# EAGLE design Teensy_Board_Connectors (EAGLE 7.0.0)
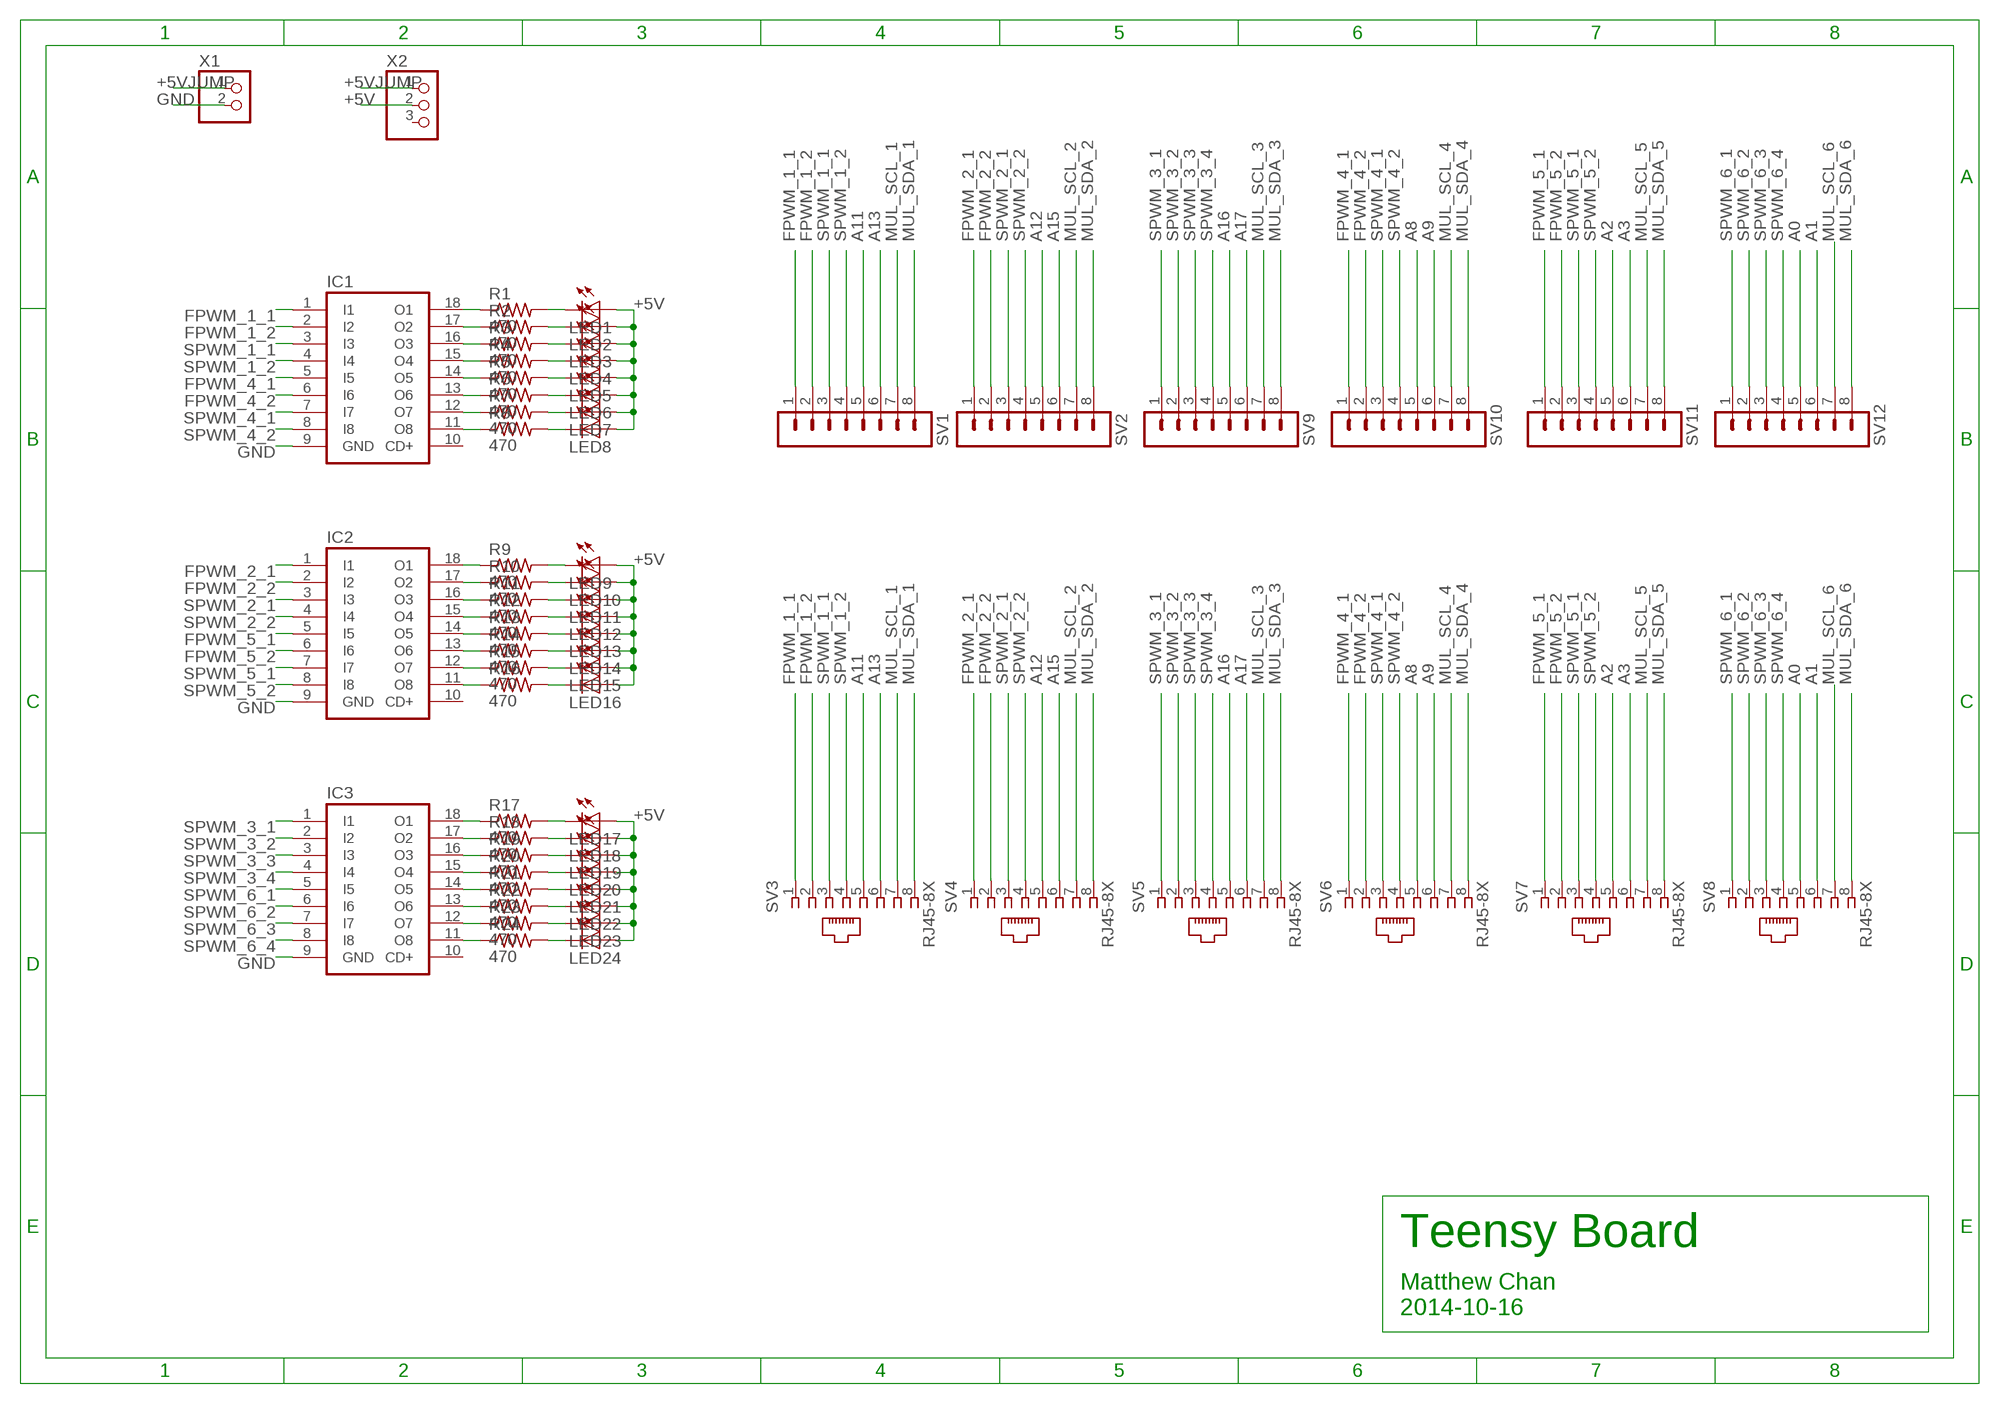
[diagram p0: schematic, sheet 1]

## Parts
IC1  ULN2803AFWG  [SOP18]
IC2  ULN2803AFWG  [SOP18]
IC3  ULN2803AFWG  [SOP18]
LED1  LEDSML1206  [SML1206]
LED2  LEDSML1206  [SML1206]
LED3  LEDSML1206  [SML1206]
LED4  LEDSML1206  [SML1206]
LED5  LEDSML1206  [SML1206]
LED6  LEDSML1206  [SML1206]
LED7  LEDSML1206  [SML1206]
LED8  LEDSML1206  [SML1206]
LED9  LEDSML1206  [SML1206]
LED10  LEDSML1206  [SML1206]
LED11  LEDSML1206  [SML1206]
LED12  LEDSML1206  [SML1206]
LED13  LEDSML1206  [SML1206]
LED14  LEDSML1206  [SML1206]
LED15  LEDSML1206  [SML1206]
LED16  LEDSML1206  [SML1206]
LED17  LEDSML1206  [SML1206]
LED18  LEDSML1206  [SML1206]
LED19  LEDSML1206  [SML1206]
LED20  LEDSML1206  [SML1206]
LED21  LEDSML1206  [SML1206]
LED22  LEDSML1206  [SML1206]
LED23  LEDSML1206  [SML1206]
LED24  LEDSML1206  [SML1206]
R1  470  R-US_R0603  [R0603]
R2  470  R-US_R0603  [R0603]
R3  470  R-US_R0603  [R0603]
R4  470  R-US_R0603  [R0603]
R5  470  R-US_R0603  [R0603]
R6  470  R-US_R0603  [R0603]
R7  470  R-US_R0603  [R0603]
R8  470  R-US_R0603  [R0603]
R9  470  R-US_R0603  [R0603]
R10  470  R-US_R0603  [R0603]
R11  470  R-US_R0603  [R0603]
R12  470  R-US_R0603  [R0603]
R13  470  R-US_R0603  [R0603]
R14  470  R-US_R0603  [R0603]
R15  470  R-US_R0603  [R0603]
R16  470  R-US_R0603  [R0603]
R17  470  R-US_R0603  [R0603]
R18  470  R-US_R0603  [R0603]
R19  470  R-US_R0603  [R0603]
R20  470  R-US_R0603  [R0603]
R21  470  R-US_R0603  [R0603]
R22  470  R-US_R0603  [R0603]
R23  470  R-US_R0603  [R0603]
R24  470  R-US_R0603  [R0603]
SV1  MA08-1  [MA08-1]
SV2  MA08-1  [MA08-1]
SV3  RJ45-8X  [RJ45-NO-SHIELD]
SV4  RJ45-8X  [RJ45-NO-SHIELD]
SV5  RJ45-8X  [RJ45-NO-SHIELD]
SV6  RJ45-8X  [RJ45-NO-SHIELD]
SV7  RJ45-8X  [RJ45-NO-SHIELD]
SV8  RJ45-8X  [RJ45-NO-SHIELD]
SV9  MA08-1  [MA08-1]
SV10  MA08-1  [MA08-1]
SV11  MA08-1  [MA08-1]
SV12  MA08-1  [MA08-1]
X1  PINHD-1X2  [1X02]
X2  PINHD-1X3  [1X03]

## Nets
+5V: LED1.A LED2.A LED3.A LED4.A LED5.A LED6.A LED7.A LED8.A LED9.A LED10.A LED11.A LED12.A LED13.A LED14.A LED15.A LED16.A LED17.A LED18.A LED19.A LED20.A LED21.A LED22.A LED23.A LED24.A X2.2
+5VJUMP: X1.1 X2.1
A0: SV8.5 SV12.5
A1: SV8.6 SV12.6
A2: SV7.5 SV11.5
A3: SV7.6 SV11.6
A8: SV6.5 SV10.5
A9: SV6.6 SV10.6
A11: SV1.5 SV3.5
A12: SV2.5 SV4.5
A13: SV1.6 SV3.6
A15: SV2.6 SV4.6
A16: SV5.5 SV9.5
A17: SV5.6 SV9.6
FPWM_1_1: IC1.1(I1) SV1.1 SV3.1
FPWM_1_2: IC1.2(I2) SV1.2 SV3.2
FPWM_2_1: IC2.1(I1) SV2.1 SV4.1
FPWM_2_2: IC2.2(I2) SV2.2 SV4.2
FPWM_4_1: IC1.5(I5) SV6.1 SV10.1
FPWM_4_2: IC1.6(I6) SV6.2 SV10.2
FPWM_5_1: IC2.5(I5) SV7.1 SV11.1
FPWM_5_2: IC2.6(I6) SV7.2 SV11.2
GND: IC1.9(GND) IC2.9(GND) IC3.9(GND) X1.2
MUL_SCL_1: SV1.7 SV3.7
MUL_SCL_2: SV2.7 SV4.7
MUL_SCL_3: SV5.7 SV9.7
MUL_SCL_4: SV6.7 SV10.7
MUL_SCL_5: SV7.7 SV11.7
MUL_SCL_6: SV8.7 SV12.7
MUL_SDA_1: SV1.8 SV3.8
MUL_SDA_2: SV2.8 SV4.8
MUL_SDA_3: SV5.8 SV9.8
MUL_SDA_4: SV6.8 SV10.8
MUL_SDA_5: SV7.8 SV11.8
MUL_SDA_6: SV8.8 SV12.8
N$1: IC1.18(O1) R1.1
N$2: LED1.C R1.2
N$3: IC1.17(O2) R2.1
N$4: IC1.16(O3) R3.1
N$5: IC1.15(O4) R4.1
N$6: IC1.14(O5) R5.1
N$7: IC1.13(O6) R6.1
N$8: IC1.12(O7) R7.1
N$10: IC1.11(O8) R8.1
N$11: LED2.C R2.2
N$12: LED3.C R3.2
N$13: LED4.C R4.2
N$14: LED5.C R5.2
N$15: LED6.C R6.2
N$16: LED7.C R7.2
N$17: LED8.C R8.2
N$18: IC2.18(O1) R9.1
N$19: LED9.C R9.2
N$20: IC2.17(O2) R10.1
N$21: IC2.16(O3) R11.1
N$22: IC2.15(O4) R12.1
N$23: IC2.14(O5) R13.1
N$24: IC2.13(O6) R14.1
N$25: IC2.12(O7) R15.1
N$26: IC2.11(O8) R16.1
N$27: LED10.C R10.2
N$28: LED11.C R11.2
N$29: LED12.C R12.2
N$30: LED13.C R13.2
N$31: LED14.C R14.2
N$32: LED15.C R15.2
N$33: LED16.C R16.2
N$34: IC3.18(O1) R17.1
N$35: LED17.C R17.2
N$36: IC3.17(O2) R18.1
N$37: IC3.16(O3) R19.1
N$38: IC3.15(O4) R20.1
N$39: IC3.14(O5) R21.1
N$40: IC3.13(O6) R22.1
N$41: IC3.12(O7) R23.1
N$42: IC3.11(O8) R24.1
N$43: LED18.C R18.2
N$44: LED19.C R19.2
N$45: LED20.C R20.2
N$46: LED21.C R21.2
N$47: LED22.C R22.2
N$48: LED23.C R23.2
N$49: LED24.C R24.2
SPWM_1_1: IC1.3(I3) SV1.3 SV3.3
SPWM_1_2: IC1.4(I4) SV1.4 SV3.4
SPWM_2_1: IC2.3(I3) SV2.3 SV4.3
SPWM_2_2: IC2.4(I4) SV2.4 SV4.4
SPWM_3_1: IC3.1(I1) SV5.1 SV9.1
SPWM_3_2: IC3.2(I2) SV5.2 SV9.2
SPWM_3_3: IC3.3(I3) SV5.3 SV9.3
SPWM_3_4: IC3.4(I4) SV5.4 SV9.4
SPWM_4_1: IC1.7(I7) SV6.3 SV10.3
SPWM_4_2: IC1.8(I8) SV6.4 SV10.4
SPWM_5_1: IC2.7(I7) SV7.3 SV11.3
SPWM_5_2: IC2.8(I8) SV7.4 SV11.4
SPWM_6_1: IC3.5(I5) SV8.1 SV12.1
SPWM_6_2: IC3.6(I6) SV8.2 SV12.2
SPWM_6_3: IC3.7(I7) SV8.3 SV12.3
SPWM_6_4: IC3.8(I8) SV8.4 SV12.4
Unconnected: IC1.10(CD+) IC2.10(CD+) IC3.10(CD+) X2.3

## Notes on the sheet
- Teensy Board
- Matthew Chan
  2014-10-16

## Library data of the parts
IC1-IC3 = CBLA_Test_bed_Library:ULN2803A: DRIVER ARRAY
LED1-LED24 = led:LED: LED OSRAM: - CHIPLED LG R971, LG N971, LY N971, LG Q971, LY Q971, LO R971, LY R971 LH N974, LH R974 LS Q976, LO Q976, LY Q976 LO Q996 - Hyper CHIPLED LW Q18S LB Q993, LB Q99A, LB R99A - SideLED LS A670, LO A670, LY A670, LG A670, LP A670 LB A673, LV A673, LT A673, LW A673 LH A674 LY A675 LS A676, LA A676, LO A676, LY A676, LW A676 LS A679, LY A679, LG A679 - Hyper Micro SIDELED® LS Y876, LA Y876, LO Y876, LY Y876 LT Y87S - SmartLED LW L88C, LW L88S LB L89C, LB L89S, LG L890 LS L89K, LO L89K, LY L89K LS L896, LA L896, LO L896, LY L896 - TOPLED LS T670, LO T670, LY T670, LG T670, LP T670 LSG T670, LSP T670, LSY T670, LOP T670, LYG T670 LG T671, LOG T671, LSG T671 LB T673, LV T673, LT T673, LW T673 LH T674 LS T676, LA T676, LO T676, LY T676, LB T676, LH T676, LSB T676, LW T676 LB T67C, LV T67C, LT T67C, LS T67K, LO T67K, LY T67K, LW E67C LS E67B, LA E67B, LO E67B, LY E67B, LB E67C, LV E67C, LT E67C LW T67C LS T679, LY T679, LG T679 LS T770, LO T770, LY T770, LG T770, LP T770 LB T773, LV T773, LT T773, LW T773 LH T774 LS E675, LA E675, LY E675, LS T675 LS T776, LA T776, LO T776, LY T776, LB T776 LHGB T686 LT T68C, LB T68C - Hyper Mini TOPLED® LB M676 - Mini TOPLED Santana® LG M470 LS M47K, LO M47K, LY M47K Source: http://www.osram.convergy.de LUXEON: - LUMILED® LXK2-PW12-R00, LXK2-PW12-S00, LXK2-PW14-U00, LXK2-PW14-V00 LXK2-PM12-R00, LXK2-PM12-S00, LXK2-PM14-U00 LXK2-PE12-Q00, LXK2-PE12-R00, LXK2-PE12-S00, LXK2-PE14-T00, LXK2-PE14-U00 LXK2-PB12-K00, LXK2-PB12-L00, LXK2-PB12-M00, LXK2-PB14-N00, LXK2-PB14-P00, LXK2-PB14-Q00 LXK2-PR12-L00, LXK2-PR12-M00, LXK2-PR14-Q00, LXK2-PR14-R00 LXK2-PD12-Q00, LXK2-PD12-R00, LXK2-PD12-S00 LXK2-PH12-R00, LXK2-PH12-S00 LXK2-PL12-P00, LXK2-PL12-Q00, LXK2-PL12-R00 Source: www.luxeon.com KINGBRIGHT: KA-3528ASYC Source: www.kingbright.com
R1-R24 = CBLA_Test_bed_Library:R-US_: RESISTOR, American symbol
SV1 SV2 SV9-SV12 = con-lstb:MA08-1: PIN HEADER; OC_FARNELL: unknown; OC_NEWARK: unknown
SV3-SV8 = CBLA_Test_bed_Library:RJ45: CORCOM Modular RJ Jacks No Shield Source: www.tycoelectronics.com .. ENG_DS_1654001_1099_RJ_L_0507.pdf; MPN: RJ45-8X; OC_FARNELL: unknown; OC_NEWARK: 16R6101
X1 = CBLA_Test_bed_Library:PINHD-1X2: PIN HEADER
X2 = CBLA_Test_bed_Library:PINHD-1X3: PIN HEADER

## Board
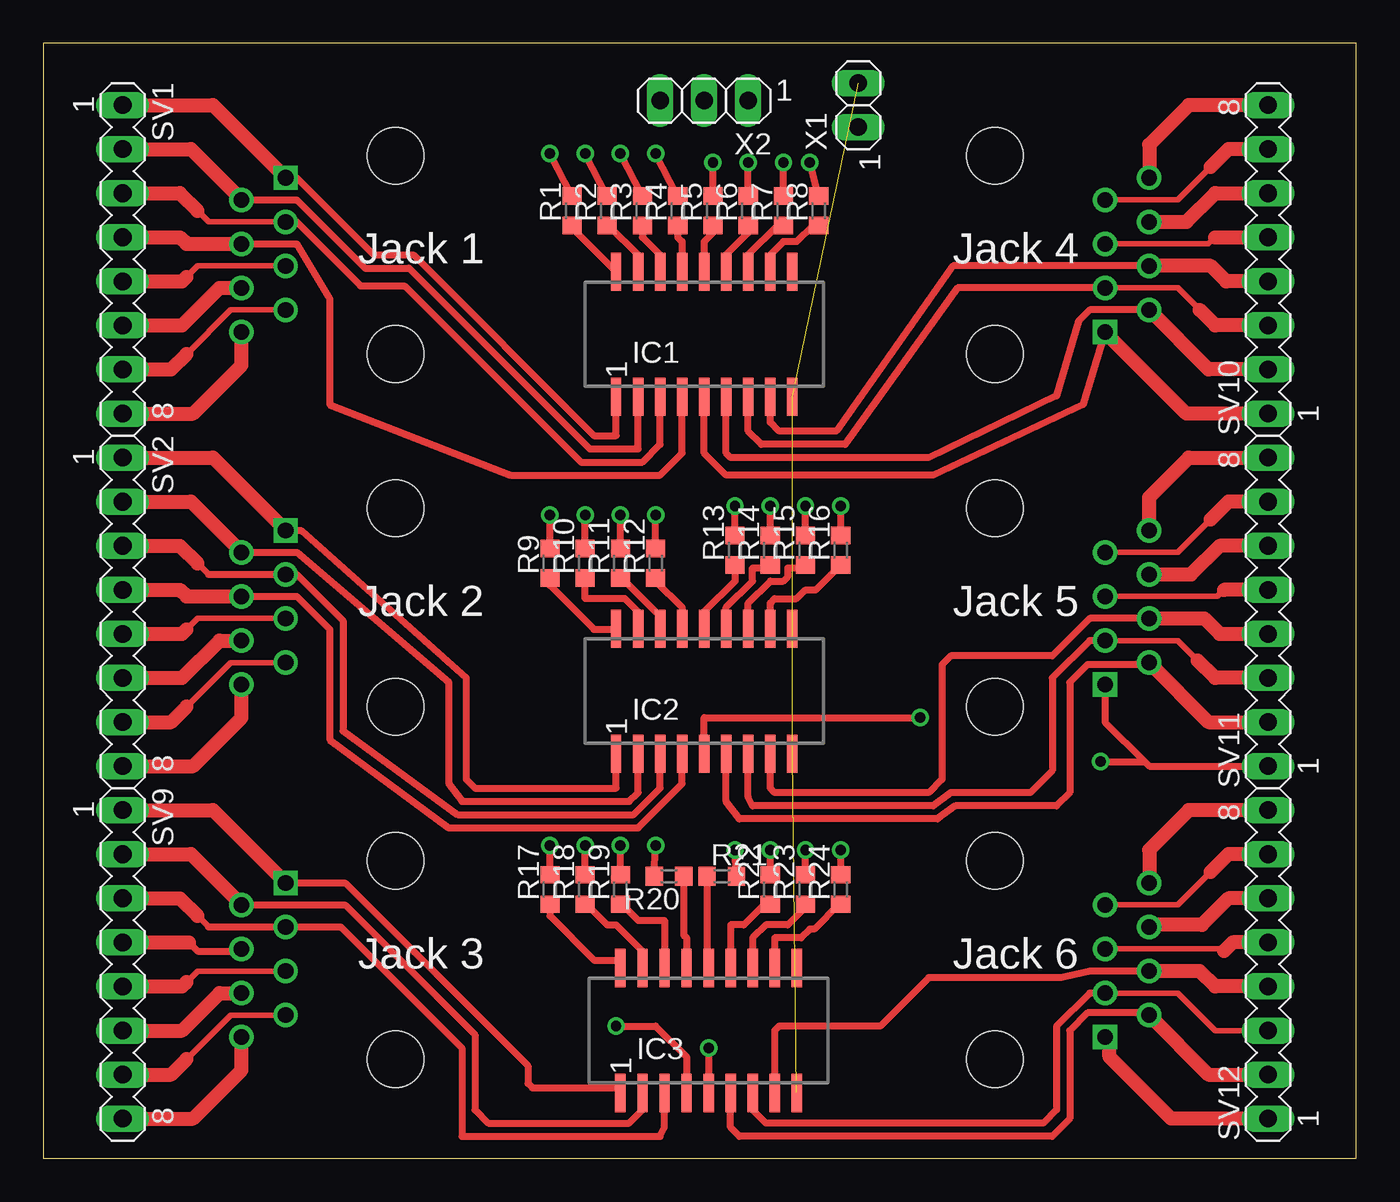
[diagram p1: board, top side]
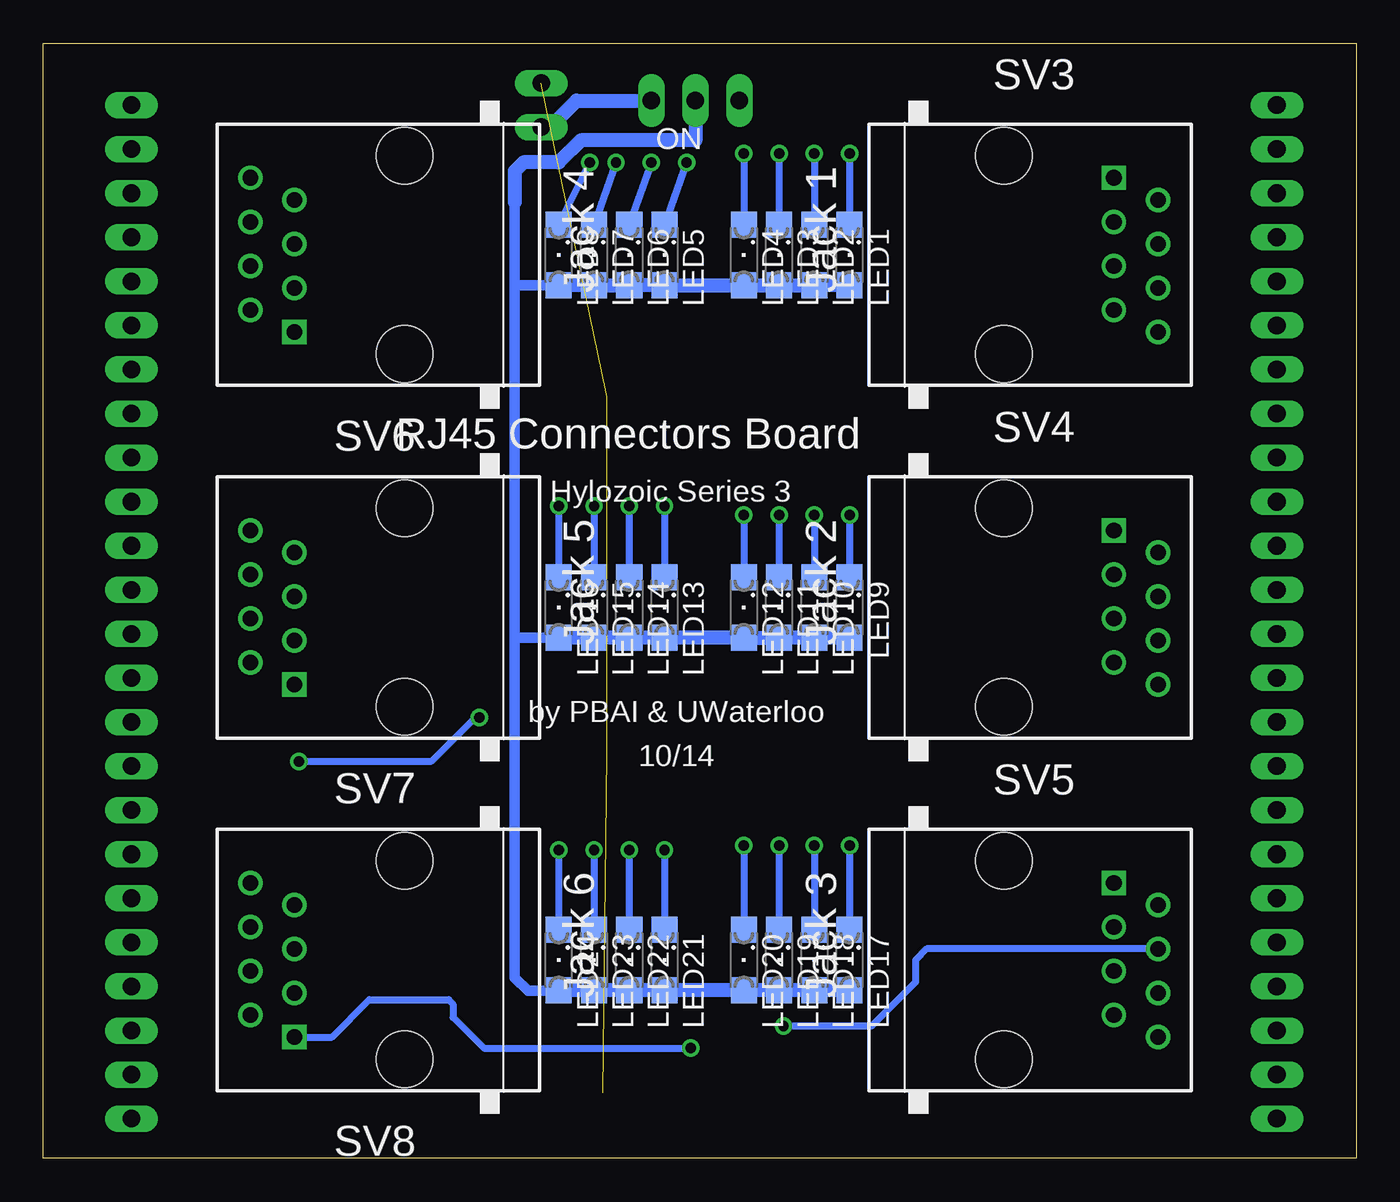
[diagram p2: board, bottom side, seen from below]

Size 75.69 x 64.26 mm. Coordinates in mm from the lower left corner, seen from the top.
Outline: 0,0 75.69,0 75.69,64.26 0,64.26 0,0
Copper layers (1*16): Top 0.035mm / dielectric 1.5mm / Bottom 0.035mm
Design rules "default": minimum track width 10mil, minimum drill 24mil, track to track 8mil, track to pad 8mil, pad to pad 8mil, via to via 8mil, smd to smd 8mil, copper to edge 40mil, drill to drill 8mil, minimum pad ring 10mil, minimum via ring 8mil, stop-mask expansion 4mil, vias tented up to drill 0mil, thermal gap 10mil

### Footprints (pad centres in the part's own frame; a part is rotated, then mirrored left to right if it is on the bottom)
SOP18 = smd 0.6 x 2.2: 1 -5.08,-3.6; 2 -3.81,-3.6; 3 -2.54,-3.6; 4 -1.27,-3.6; 5 0,-3.6; 6 1.27,-3.6; 7 2.54,-3.6; 8 3.81,-3.6; 9 5.08,-3.6; 10 5.08,3.6; 11 3.81,3.6; 12 2.54,3.6; 13 1.27,3.6; 14 0,3.6; 15 -1.27,3.6; 16 -2.54,3.6; 17 -3.81,3.6; 18 -5.08,3.6
SML1206 = smd 1.5 x 1.5: A 1.75,0; C -1.75,0
R0603 = smd 1 x 1.1: 1 -0.85,0; 2 0.85,0
MA08-1 = drill 1.016 long: 1 -8.89,0; 2 -6.35,0; 3 -3.81,0; 4 -1.27,0; 5 1.27,0; 6 3.81,0; 7 6.35,0; 8 8.89,0
RJ45-NO-SHIELD = drill 0.9 pad 1.4 square: 1 -4.445,6.35 | drill 0.9 pad 1.4: 2 -3.175,8.89; 3 -1.905,6.35; 4 -0.635,8.89; 5 0.635,6.35; 6 1.905,8.89; 7 3.175,6.35; 8 4.445,8.89 | hole 3.251: -5.715,0; 5.715,0
1X02 = drill 1.016 long: 1 -1.27,0; 2 1.27,0
1X03 = drill 1.016 long: 1 -2.54,0; 2 0,0; 3 2.54,0

### Placement (x,y rotation side)
IC1  38.1,47.5 0 top
IC2  38.1,26.92 0 top
IC3  38.35,7.37 0 top
LED1  29.21,52.07 270 bottom
LED2  31.24,52.07 270 bottom
LED3  33.27,52.07 270 bottom
LED4  35.31,52.07 270 bottom
LED5  39.88,52.07 270 bottom
LED6  41.91,52.07 270 bottom
LED7  43.94,52.07 270 bottom
LED8  45.97,52.07 270 bottom
LED9  29.21,31.75 270 bottom
LED10  31.24,31.75 270 bottom
LED11  33.27,31.75 270 bottom
LED12  35.31,31.75 270 bottom
LED13  39.88,31.75 270 bottom
LED14  41.91,31.75 270 bottom
LED15  43.94,31.75 270 bottom
LED16  45.97,31.75 270 bottom
LED17  29.21,11.43 270 bottom
LED18  31.24,11.43 270 bottom
LED19  33.27,11.43 270 bottom
LED20  35.31,11.43 270 bottom
LED21  39.88,11.43 270 bottom
LED22  41.91,11.43 270 bottom
LED23  43.94,11.43 270 bottom
LED24  45.97,11.43 270 bottom
R1  30.48,54.61 90 top
R2  32.51,54.61 90 top
R3  34.54,54.61 90 top
R4  36.58,54.61 90 top
R5  38.61,54.61 90 top
R6  40.64,54.61 90 top
R7  42.67,54.61 90 top
R8  44.7,54.61 90 top
R9  29.21,34.29 90 top
R10  31.24,34.29 90 top
R11  33.27,34.29 90 top
R12  35.31,34.29 90 top
R13  39.88,35.05 90 top
R14  41.91,35.05 90 top
R15  43.94,35.05 90 top
R16  45.97,35.05 90 top
R17  29.21,15.49 90 top
R18  31.24,15.49 90 top
R19  33.27,15.49 90 top
R20  36.07,16.26 180 top
R21  39.12,16.26 0 top
R22  41.91,15.49 90 top
R23  43.94,15.49 90 top
R24  45.97,15.49 90 top
SV1  4.57,51.82 270 top
SV2  4.57,31.5 270 top
SV3  20.32,52.07 270 bottom
SV4  20.32,31.75 270 bottom
SV5  20.32,11.43 270 bottom
SV6  54.86,52.07 90 bottom
SV7  54.86,31.75 90 bottom
SV8  54.86,11.43 90 bottom
SV9  4.57,11.18 270 top
SV10  70.61,51.82 90 top
SV11  70.61,31.5 90 top
SV12  70.61,11.18 90 top
X1  46.99,60.71 90 top
X2  38.1,60.96 180 top

### Tracks (layer width: path | path; a pad name or v marks a point on that pad's centre or on a via)
+5V
  Bottom 0.406: LED24.A 45.97,9.91 45.72,10.16 45.97,10.16 46.48,9.65 | LED16.A 46,29.97 48.51,29.97 48.49,30 | LED8.A 46,50.29 48.51,50.29 48.49,50.32
  Bottom 0.61: 46.48,9.65 47.75,9.65 48.51,10.41 48.51,29.97 48.51,50.29 48.51,55.12 | LED16.A 48.49,30 | LED8.A 48.49,50.32
  Bottom 0.813: LED8.A LED7.A LED6.A LED5.A LED4.A LED3.A LED2.A LED1.A | LED16.A LED15.A LED14.A LED13.A LED12.A LED11.A LED10.A LED9.A | LED17.A LED18.A LED19.A LED20.A LED21.A LED22.A LED23.A LED24.A | X2.2 38.1,58.67 44.7,58.67 45.97,57.4 48.01,57.4 48.51,56.9 48.51,55.12
+5VJUMP
  Bottom 0.406: 40.89,60.71 X2.1 | X1.1 46.48,59.44
  Bottom 0.813: 46.48,59.44 44.96,60.96 X2.1
A0
  Top 0.305: SV8.5 67.94,12.06 68.07,11.94
  Top 0.813: SV12.5 68.58,12.45 68.07,11.94
A1
  Top 0.813: SV12.6 68.33,14.99 66.8,13.46 63.88,13.46 SV8.6
A2
  Top 0.305: 68.07,32.77 67.69,32.39 SV7.5
  Top 0.813: SV11.5 68.07,32.77
A3
  Top 0.813: SV11.6 67.82,35.31 66.17,33.66 SV7.6
A8
  Top 0.305: SV6.5 67.18,52.7 67.56,53.09
  Top 0.813: 67.56,53.09 SV10.5
A9
  Top 0.813: SV6.6 65.91,53.97 67.56,55.63 SV10.6
A11
  Top 0.305: 8.26,50.8 8.89,51.43 SV3.5
  Top 0.813: SV1.5 8,50.55 8.26,50.8
A12
  Top 0.305: 8.26,30.48 8.89,31.11 SV4.5
  Top 0.813: SV2.5 8,30.23 8.26,30.48
A13
  Top 0.813: SV1.6 8,48.01 10.16,50.16 SV3.6
A15
  Top 0.813: SV2.6 8,27.69 10.16,29.84 SV4.6
A16
  Top 0.305: 8.26,10.16 8.89,10.79 SV5.5
  Top 0.813: SV9.5 8,9.91 8.26,10.16
A17
  Top 0.813: SV9.6 8,7.37 10.16,9.52 SV5.6
FPWM_1_1
  Top 0.406: SV3.1 14.61,56.52 19.05,52.07 21.34,52.07 31.75,41.66 33.02,41.66 IC1.1
  Top 0.813: SV1.1 9.78,60.71 SV3.1
FPWM_1_2
  Top 0.406: SV3.2 14.61,55.24 18.54,51.31 21.08,51.31 31.5,40.89 34.29,40.89 IC1.2
  Top 0.813: SV1.2 8.51,58.17 SV3.2
FPWM_2_1
  Top 0.406: SV4.1 14.86,36.19 24.38,27.69 24.38,21.84 24.89,21.34 33.02,21.34 IC2.1
  Top 0.813: SV2.1 9.78,40.39 SV4.1
FPWM_2_2
  Top 0.406: SV4.2 14.61,34.92 23.37,27.43 23.37,21.59 24.13,20.57 33.78,20.57 34.29,21.08 IC2.2
  Top 0.813: SV2.2 8.51,37.85 SV4.2
FPWM_4_1
  Top 0.406: SV6.1 59.94,43.43 51.31,39.37 39.37,39.37 38.1,40.64 IC1.5
  Top 0.813: SV10.1 65.91,42.93 SV6.1
FPWM_4_2
  Top 0.406: SV6.2 60.33,48.89 59.69,48.26 58.42,43.94 51.05,40.39 39.62,40.39 39.37,40.64 IC1.6
  Top 0.813: SV10.2 67.18,45.47 SV6.2
FPWM_5_1  (via drill 0.6)
  Top 0.406: SV7.1 61.21,25.15 63.5,22.86 | 63.5,22.86 63.75,22.61 SV11.1 | IC2.5 38.1,25.4 v50.55,25.4 | v60.96,22.86 63.5,22.86
  Bottom 0.406: v50.55,25.4 50.8,25.4 53.34,22.86 v60.96,22.86
FPWM_5_2
  Top 0.406: 67.18,25.15 67.18,25.27 63.5,28.96 63.5,28.45 60.2,28.45 59.18,27.43 59.18,21.08 58.42,20.32 52.58,20.32 51.56,19.56 40.13,19.56 39.37,20.57 IC2.6
  Top 0.813: SV7.2 67.18,25.15 SV11.2
GND  (3 unrouted)
MUL_SCL_1
  Top 0.305: 8.26,46.36 10.79,48.89 SV3.7
  Top 0.813: SV1.7 7.37,45.47 8.26,46.36
MUL_SCL_2
  Top 0.305: 8.26,26.04 10.79,28.57 SV4.7
  Top 0.813: SV2.7 7.37,25.15 8.26,26.04
MUL_SCL_3
  Top 0.305: 8.26,5.71 10.79,8.25 SV5.7
  Top 0.813: SV9.7 7.37,4.83 8.26,5.71
MUL_SCL_4
  Top 0.305: SV6.7 65.41,55.24 67.31,57.15
  Top 0.813: SV10.7 68.33,58.17 67.31,57.15
MUL_SCL_5
  Top 0.305: 67.31,36.83 65.41,34.92 SV7.7
  Top 0.813: SV11.7 68.33,37.85 67.31,36.83
MUL_SCL_6
  Top 0.305: SV8.7 65.41,14.6 67.31,16.51
  Top 0.813: SV12.7 68.33,17.53 67.31,16.51
MUL_SDA_1
  Top 0.813: SV1.8 8.64,42.93 11.43,45.72 SV3.8
MUL_SDA_2
  Top 0.813: SV2.8 8.64,22.61 11.43,25.4 SV4.8
MUL_SDA_3
  Top 0.813: SV9.8 8.64,2.29 11.43,5.08 SV5.8
MUL_SDA_4
  Top 0.813: SV10.8 66.04,60.71 63.75,58.42 SV6.8
MUL_SDA_5
  Top 0.813: SV7.8 63.75,38.1 66.04,40.39 SV11.8
MUL_SDA_6
  Top 0.813: SV12.8 66.04,20.07 63.75,17.78 SV8.8
N$1
  Top 0.406: R1.1 30.48,53.64 IC1.18
N$2  (via drill 0.6)
  Top 0.406: R1.2 v29.21,57.91
  Bottom 0.406: v29.21,57.91 LED1.C
N$3
  Top 0.406: R2.1 32.6,53.76 34.29,52.07 IC1.17
N$4
  Top 0.406: R3.1 34.54,53.09 35.56,52.07 IC1.16
N$5
  Top 0.406: R4.1 36.58,53.09 36.83,52.83 IC1.15
N$6
  Top 0.406: R5.1 38.61,53.34 38.1,52.83 IC1.14
N$7
  Top 0.406: R6.1 40.64,53.34 39.37,52.07 IC1.13
N$8
  Top 0.406: R7.1 42.33,53.76 40.64,52.07 IC1.12
N$10
  Top 0.406: R8.1 44.36,53.76 43.43,52.83 42.67,52.83 41.91,52.07 IC1.11
N$11  (via drill 0.6)
  Top 0.406: R2.2 v31.24,57.91
  Bottom 0.406: v31.24,57.91 LED2.C
N$12  (via drill 0.6)
  Top 0.406: R3.2 v33.27,57.91
  Bottom 0.406: v33.27,57.91 LED3.C
N$13  (via drill 0.6)
  Top 0.406: R4.2 v35.31,57.91
  Bottom 0.406: v35.31,57.91 LED4.C
N$14  (via drill 0.6)
  Top 0.406: R5.2 v38.61,57.4
  Bottom 0.406: v38.61,57.4 LED5.C
N$15  (via drill 0.6)
  Top 0.406: R6.2 v40.64,57.4
  Bottom 0.406: v40.64,57.4 LED6.C
N$16  (via drill 0.6)
  Top 0.406: R7.2 v42.67,57.4
  Bottom 0.406: v42.67,57.4 LED7.C
N$17  (via drill 0.6)
  Top 0.406: R8.2 v44.2,57.4
  Bottom 0.406: v44.2,57.4 LED8.C
N$18
  Top 0.406: R9.1 29.21,33.02 31.75,30.48 32.81,30.48 IC2.18
N$19  (via drill 0.6)
  Top 0.406: R9.2 v29.21,37.08
  Bottom 0.406: v29.21,37.08 LED9.C
N$20
  Top 0.406: IC2.17 34.29,31.5 33.53,32.26 31.24,32.26 R10.1
N$21
  Top 0.406: R11.1 33.36,33.44 35.56,31.24 IC2.16
N$22
  Top 0.406: R12.1 35.31,33.27 36.83,31.75 IC2.15
N$23
  Top 0.406: R13.1 39.88,33.27 38.1,31.5 IC2.14
N$24
  Top 0.406: IC2.13 39.37,31.75 40.89,33.27 40.89,34.04 41.74,34.04 R14.1
N$25
  Top 0.406: IC2.12 40.64,32 41.91,33.27 42.67,33.27 42.93,33.53 42.93,34.04 43.78,34.04 R15.1
N$26
  Top 0.406: IC2.11 41.91,32 42.16,32.26 43.43,32.26 43.94,32.77 44.54,32.77 R16.1
N$27  (via drill 0.6)
  Top 0.406: R10.2 v31.24,37.08
  Bottom 0.406: v31.24,37.08 LED10.C
N$28  (via drill 0.6)
  Top 0.406: R11.2 v33.27,37.08
  Bottom 0.406: v33.27,37.08 LED11.C
N$29  (via drill 0.6)
  Top 0.406: R12.2 v35.31,37.08
  Bottom 0.406: v35.31,37.08 LED12.C
N$30  (via drill 0.6)
  Top 0.406: R13.2 v39.88,37.59
  Bottom 0.406: v39.88,37.59 LED13.C
N$31  (via drill 0.6)
  Top 0.406: R14.2 v41.91,37.59
  Bottom 0.406: v41.91,37.59 LED14.C
N$32  (via drill 0.6)
  Top 0.406: R15.2 v43.94,37.59
  Bottom 0.406: v43.94,37.59 LED15.C
N$33  (via drill 0.6)
  Top 0.406: R16.2 v45.97,37.59
  Bottom 0.406: v45.97,37.59 LED16.C
N$34
  Top 0.406: R17.1 29.21,13.97 31.75,11.43 33.27,11.43 IC3.18 33.27,10.41
N$35  (via drill 0.6)
  Top 0.406: R17.2 v29.21,18.03
  Bottom 0.406: v29.21,18.03 LED17.C
N$36
  Top 0.406: R18.1 31.33,14.64 32.51,13.46 33.02,13.46 34.54,11.94 IC3.17
N$37
  Top 0.406: R19.1 33.36,14.64 34.29,13.72 35.81,13.72 IC3.16
N$38
  Top 0.406: R20.1 36.92,12.87 37.08,12.7 IC3.15
N$39
  Top 0.406: R21.1 38.27,11.05 IC3.14
N$40
  Top 0.406: R22.1 41.57,14.64 40.39,13.46 39.62,13.46 IC3.13
N$41
  Top 0.406: R23.1 43.94,14.48 42.93,13.46 41.66,13.46 40.89,12.7 IC3.12
N$42
  Top 0.406: R24.1 45.89,14.64 44.45,13.21 44.2,13.21 43.69,12.7 42.16,12.7 IC3.11
N$43  (via drill 0.6)
  Top 0.406: R18.2 v31.24,18.03
  Bottom 0.406: v31.24,18.03 LED18.C
N$44  (via drill 0.6)
  Top 0.406: R19.2 v33.27,18.03
  Bottom 0.406: v33.27,18.03 LED19.C
N$45  (via drill 0.6)
  Top 0.406: R20.2 v35.31,18.03
  Bottom 0.406: v35.31,18.03 LED20.C
N$46  (via drill 0.6)
  Top 0.406: R21.2 v39.88,17.78
  Bottom 0.406: v39.88,17.78 LED21.C
N$47  (via drill 0.6)
  Top 0.406: R22.2 v41.91,17.78
  Bottom 0.406: v41.91,17.78 LED22.C
N$48  (via drill 0.6)
  Top 0.406: R23.2 v43.94,17.78
  Bottom 0.406: v43.94,17.78 LED23.C
N$49  (via drill 0.6)
  Top 0.406: R24.2 v45.97,17.78
  Bottom 0.406: v45.97,17.78 LED24.C
SPWM_1_1
  Top 0.305: 8.89,54.61 9.53,53.97 SV3.3
  Top 0.406: SV3.3 14.61,53.97 18.29,50.29 20.83,50.29 30.99,40.13 34.54,40.13 35.56,41.15 IC1.3
  Top 0.813: SV1.3 7.87,55.63 8.89,54.61
SPWM_1_2
  Top 0.406: SV3.4 14.61,52.7 16.51,49.53 16.51,43.43 26.92,39.37 35.56,39.37 36.83,40.64 IC1.4
  Top 0.813: SV1.4 7.87,53.09 8.26,52.7 SV3.4
SPWM_2_1
  Top 0.305: 8.89,34.29 9.53,33.66 SV4.3
  Top 0.406: 9.53,33.66 14.61,33.66 17.27,30.99 17.27,24.64 23.88,19.81 34.04,19.81 35.56,21.34 IC2.3
  Top 0.813: SV2.3 7.87,35.31 8.89,34.29
SPWM_2_2
  Top 0.406: 8.26,32.39 14.61,32.39 16.51,30.48 16.51,24.13 23.37,19.05 34.29,19.05 36.83,21.59 IC2.4
  Top 0.813: SV2.4 7.87,32.77 8.26,32.39 SV4.4
SPWM_3_1
  Top 0.406: IC3.1 32.98,4.06 28.19,4.06 27.94,4.32 27.94,5.33 17.4,15.87 SV5.1
  Top 0.813: SV9.1 9.78,20.07 SV5.1
SPWM_3_2
  Top 0.406: SV5.2 17.4,14.6 24.89,7.11 24.89,2.79 25.65,2.03 33.78,2.03 34.54,2.79 IC3.2
  Top 0.813: SV9.2 8.51,17.53 SV5.2
SPWM_3_3
  Top 0.305: 8.89,13.97 9.53,13.33 SV5.3
  Top 0.406: 9.53,13.33 17.14,13.33 24.13,6.35 24.13,1.27 35.56,1.27 35.81,1.78 IC3.3
  Top 0.813: SV9.3 7.87,14.99 8.89,13.97
SPWM_3_4  (via drill 0.6)
  Top 0.406: 8.38,12.45 8.89,11.94 11.3,11.94 SV5.4 | v33.02,7.62 35.31,7.62 37.08,5.84 IC3.4
  Top 0.813: SV9.4 8.38,12.45
  Bottom 0.406: SV5.4 24.77,12.06 25.4,11.43 25.4,10.16 27.94,7.62 v33.02,7.62
SPWM_4_1
  Top 0.305: SV6.3 65.41,50.16 66.67,48.89
  Top 0.406: SV6.3 52.7,50.16 46.23,41.15 41.4,41.15 40.64,41.91 IC1.7
  Top 0.813: SV10.3 67.56,48.01 66.67,48.89
SPWM_4_2
  Top 0.406: SV6.4 52.45,51.43 45.72,41.91 42.42,41.91 41.91,42.42 IC1.8
  Top 0.813: SV10.4 68.2,50.55 67.31,51.43 SV6.4
SPWM_5_1
  Top 0.305: SV7.3 65.41,29.84 66.55,28.7
  Top 0.406: SV7.3 60.33,29.84 58.17,27.69 58.17,22.35 56.9,21.08 52.32,21.08 51.31,20.32 40.89,20.32 40.64,20.83 IC2.7
  Top 0.813: SV11.3 67.56,27.69 66.55,28.7
SPWM_5_2
  Top 0.406: SV7.4 60.33,31.11 58.17,28.96 52.32,28.96 51.82,28.45 51.82,21.84 51.05,21.08 42.16,21.08 41.91,21.34 IC2.8
  Top 0.813: SV7.4 66.93,31.11 67.82,30.23 SV11.4
SPWM_6_1  (via drill 0.6)
  Top 0.406: v38.35,6.35 IC3.5
  Top 0.813: SV12.1 65.02,2.29 61.47,5.84 61.47,6.73 SV8.1
  Bottom 0.406: SV8.1 59.05,6.98 56.9,9.14 52.32,9.14 52.07,8.89 52.07,8.13 50.29,6.35 v38.35,6.35
SPWM_6_2
  Top 0.406: 67.18,4.83 67.18,4.95 63.75,8.38 60.2,8.38 59.18,7.37 59.18,2.29 58.17,1.27 40.13,1.27 39.62,1.78 IC3.6
  Top 0.813: SV8.2 67.18,4.83 SV12.2
SPWM_6_3
  Top 0.305: SV8.3 65.41,9.52 67.56,7.37 SV12.3
  Top 0.406: SV8.3 60.33,9.52 58.42,7.62 58.42,2.79 57.66,2.03 41.66,2.03 40.89,2.79 IC3.7
SPWM_6_4
  Top 0.406: SV8.4 60.33,10.79 58.67,10.41 51.05,10.41 48.26,7.62 42.42,7.62 42.16,7.37 IC3.8
  Top 0.813: SV12.4 67.56,9.91 66.67,10.79 SV8.4

### Text on the board
tPlace: Jack 1 | Jack 4 | Jack 2 | Jack 5 | Jack 3 | Jack 6
bPlace: ON | Jack 1 | Jack 4 | RJ45 Connectors Board | Hylozoic Series 3 | Jack 2 | Jack 5 | by PBAI & UWaterloo | 10/14 | Jack 3 | Jack 6